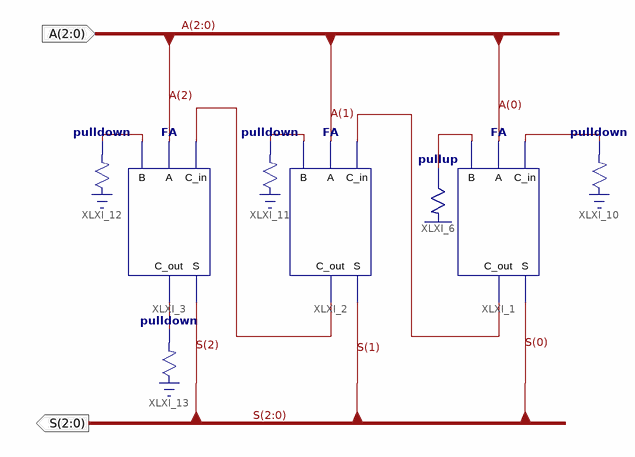
[diagram p0: schematic sheet 1]
// Xilinx ISE schematic Adder_3_bit.sch (spartan3e) as structural Verilog: 8 symbols, 2 ports
module Adder_3_bit (
  input  [2:0] A,
  output [2:0] S
);

  wire XLXN_2, XLXN_4, XLXN_27, XLXN_28, XLXN_29, XLXN_30, XLXN_31;

  FA XLXI_1 (.A(A[0]), .B(XLXN_27), .C_in(XLXN_28), .C_out(XLXN_2), .S(S[0]));
  FA XLXI_2 (.A(A[1]), .B(XLXN_29), .C_in(XLXN_2), .C_out(XLXN_4), .S(S[1]));
  FA XLXI_3 (.A(A[2]), .B(XLXN_30), .C_in(XLXN_4), .C_out(XLXN_31), .S(S[2]));
  \pullup  XLXI_6 (.O(XLXN_27));
  \pulldown  XLXI_10 (.O(XLXN_28));
  \pulldown  XLXI_11 (.O(XLXN_29));
  \pulldown  XLXI_12 (.O(XLXN_30));
  \pulldown  XLXI_13 (.O(XLXN_31));
endmodule
